# EAGLE design TRV_control_node (EAGLE 9.1.1)
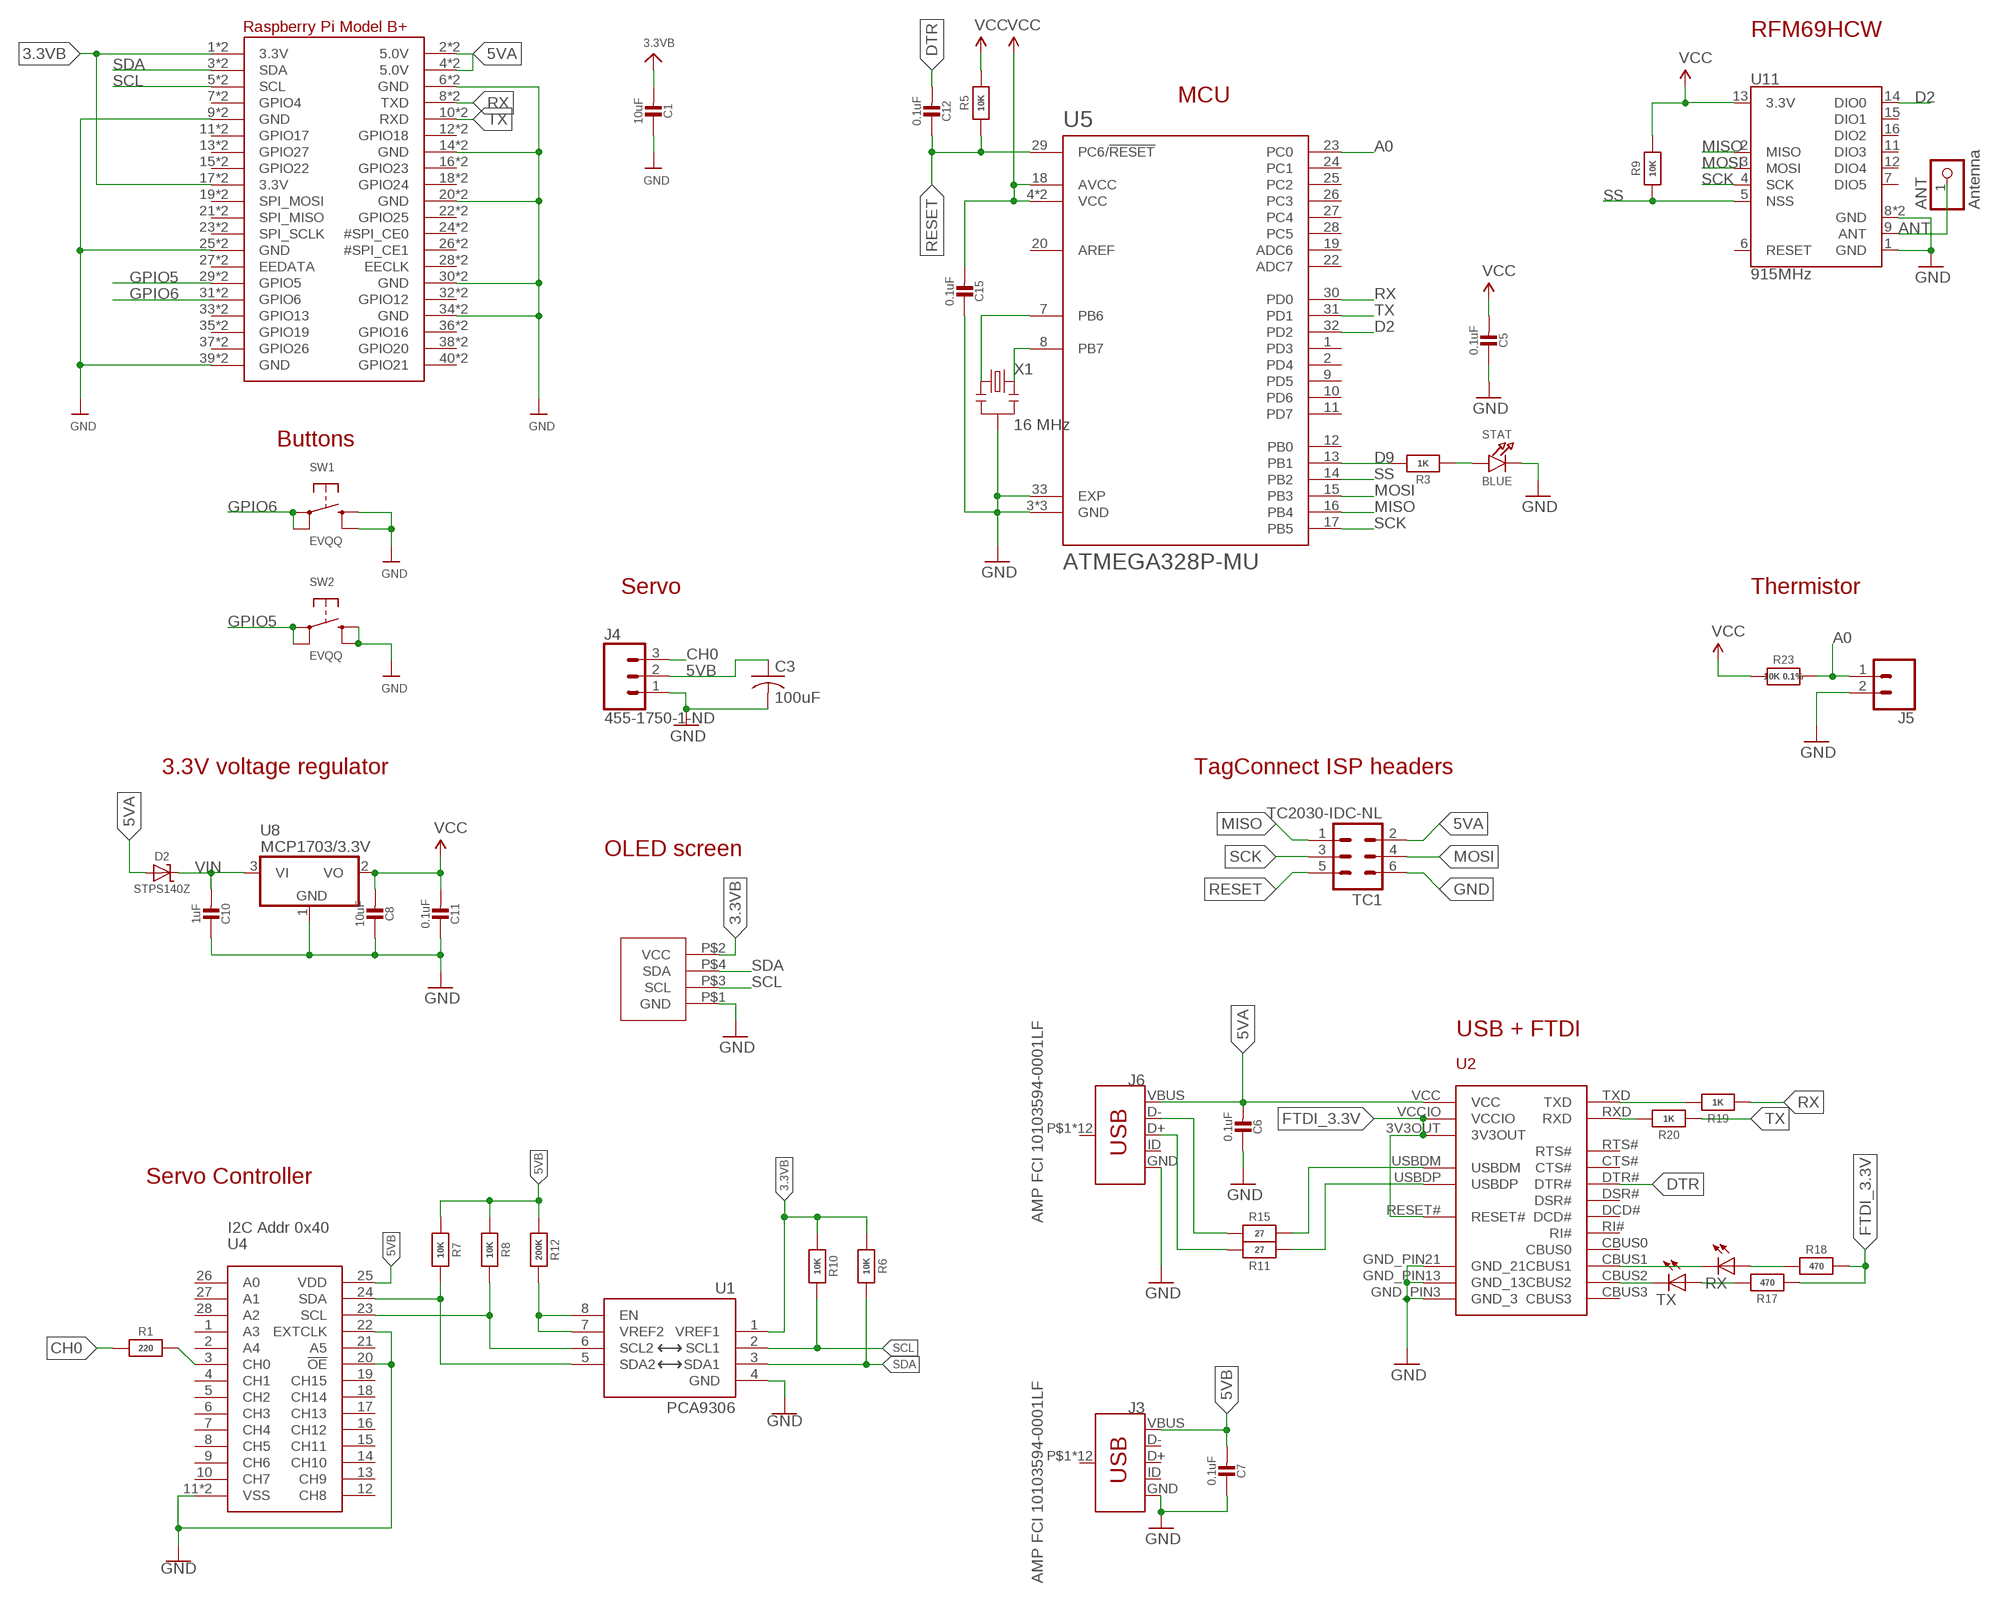
[diagram p0: schematic, sheet 1]

## Parts
ANT  Antenna  PINHD-1X1CB  [1X01-CLEANBIG]
C1  10uF  MICROBUILDER_CAP_CERAMIC_0402MP  [MICROBUILDER__0402MP]
C3  100uF  C-USC1210  [C1210]
C5  0.1uF  MICROBUILDER_CAP_CERAMIC_0402MP  [MICROBUILDER__0402MP]
C6  0.1uF  MICROBUILDER_CAP_CERAMIC_0402MP  [MICROBUILDER__0402MP]
C7  0.1uF  MICROBUILDER_CAP_CERAMIC_0402MP  [MICROBUILDER__0402MP]
C8  10uF  MICROBUILDER_CAP_CERAMIC_0402MP  [MICROBUILDER__0402MP]
C10  1uF  MICROBUILDER_CAP_CERAMIC_0402MP  [MICROBUILDER__0402MP]
C11  0.1uF  MICROBUILDER_CAP_CERAMIC_0402MP  [MICROBUILDER__0402MP]
C12  0.1uF  MICROBUILDER_CAP_CERAMIC_0402MP  [MICROBUILDER__0402MP]
C15  0.1uF  MICROBUILDER_CAP_CERAMIC_0402MP  [MICROBUILDER__0402MP]
D2  STPS140Z  MICROBUILDER_DIODE-SCHOTTKYSOD-123  [MICROBUILDER_SOD-123]
J3  AMP FCI 10103594-0001LF  USB_MICRO-B_HALF_PTH  [USB-MICROB-PTH]
J4  455-1750-1-ND  CONN_03  [1X03]
J5  CONN_02  [1X02]
J6  AMP FCI 10103594-0001LF  USB_MICRO-B_HALF_PTH  [USB-MICROB-PTH]
R1  220  MICROBUILDER_RESISTOR_0402MP  [MICROBUILDER__0402MP]
R3  1K  MICROBUILDER_RESISTOR_0402MP  [MICROBUILDER__0402MP]
R5  10K  MICROBUILDER_RESISTOR_0402MP  [MICROBUILDER__0402MP]
R6  10K  MICROBUILDER_RESISTOR_0402MP  [MICROBUILDER__0402MP]
R7  10K  MICROBUILDER_RESISTOR_0402MP  [MICROBUILDER__0402MP]
R8  10K  MICROBUILDER_RESISTOR_0402MP  [MICROBUILDER__0402MP]
R9  10K  MICROBUILDER_RESISTOR_0402MP  [MICROBUILDER__0402MP]
R10  10K  MICROBUILDER_RESISTOR_0402MP  [MICROBUILDER__0402MP]
R11  27  MICROBUILDER_RESISTOR_0402MP  [MICROBUILDER__0402MP]
R12  200K  MICROBUILDER_RESISTOR_0402MP  [MICROBUILDER__0402MP]
R15  27  MICROBUILDER_RESISTOR_0402MP  [MICROBUILDER__0402MP]
R17  470  MICROBUILDER_RESISTOR_0402MP  [MICROBUILDER__0402MP]
R18  470  MICROBUILDER_RESISTOR_0402MP  [MICROBUILDER__0402MP]
R19  1K  MICROBUILDER_RESISTOR_0402MP  [MICROBUILDER__0402MP]
R20  1K  MICROBUILDER_RESISTOR_0402MP  [MICROBUILDER__0402MP]
R23  10K 0.1%  MICROBUILDER_RESISTOR_0402MP  [MICROBUILDER__0402MP]
RPI1  RASPBERRYPI_BPLUS_BONNET_THMSMT  [PI_BONNET_THMSMT]
RX  LEDCHIPLED_0805  [CHIPLED_0805]
STAT  BLUE  LED0805_NOOUTLINE  [CHIPLED_0805_NOOUTLINE]
SW1  EVQQ  SWITCH_TACT_SMT_EVQQ2_SMALL  [EVQ-Q2_SMALLER]
SW2  EVQQ  SWITCH_TACT_SMT_EVQQ2_SMALL  [EVQ-Q2_SMALLER]
TC1  TC2030-IDC-NL  [TC2030-IDC-NL]
TX  LEDCHIPLED_0805  [CHIPLED_0805]
U1  PCA9306  [PSOP-8]
U2  FT231XQ-R  [FTDI_FT231XQ-R_PACKAGE]
U4  PCA9685HVQFN28  [HVQFN28_SOT788-1]
U5  ATMEGA328P-MU  [QFN50P500X500X100-33N]
U8  MCP1703/3.3V  MCP1703CB  [SOT23]
U11  915MHz  RFM69HCW-915  [RFM69HCW-XXXS2]
U$1  OLED_091_SSD1306  [OLED_128X32_0.91]
X1  16 MHz  RESONATORSMD  [RESONATOR-SMD]

## Nets
3.3VB: C1.2 R6.1 R10.1 RPI1.1(3.3V) RPI1.17(3.3V) RPI1.S1(3.3V) RPI1.S17(3.3V) U1.1(VREF1) U$1.P$2(VCC)
5VA: C6.2 D2.A J6.VBUS RPI1.2(5.0V) RPI1.4(5.0V) RPI1.S2(5.0V) RPI1.S4(5.0V) TC1.2 U2.VCC
5VB: C3.1 C7.2 J3.VBUS J4.2 R7.1 R8.1 R12.1 U4.25(VDD)
A0: J5.1 R23.2 U5.23(PC0)
ANT: ANT.1 U11.9(ANT)
CH0: J4.3 R1.1
D2: U5.32(PD2) U11.14(DIO0)
D9: R3.2 U5.13(PB1)
DTR: C12.2 U2.DTR#
FTDI_3.3V: R17.1 R18.2 U2.3V3OUT U2.RESET# U2.VCCIO
GND: C1.1 C3.2 C5.1 C6.1 C7.1 C8.1 C10.1 C11.1 C15.1 J3.GND J4.1 J5.2 J6.GND RPI1.6(GND) RPI1.9(GND) RPI1.14(GND) RPI1.20(GND) RPI1.25(GND) RPI1.30(GND) RPI1.34(GND) RPI1.39(GND) RPI1.S6(GND) RPI1.S9(GND) RPI1.S14(GND) RPI1.S20(GND) RPI1.S25(GND) RPI1.S30(GND) RPI1.S34(GND) RPI1.S39(GND) STAT.C SW1.B'(S1) SW1.B(S) SW2.B'(S1) SW2.B(S) TC1.6 U1.4(GND) U2.GND_PIN3(GND_3) U2.GND_PIN13(GND_13) U2.GND_PIN21(GND_21) U4.11(VSS) U4.20(!OE) U4.22(EXTCLK) U4.TH(VSS) U5.3(GND) U5.5(GND) U5.21(GND) U5.33(EXP) U8.1(GND) U11.1(GND) U11.8(GND) U11.10(GND) U$1.P$1(GND) X1.2
GPIO5: RPI1.29(GPIO5) RPI1.S29(GPIO5) SW2.A'(P1) SW2.A(P)
GPIO6: RPI1.31(GPIO6) RPI1.S31(GPIO6) SW1.A'(P1) SW1.A(P)
MISO: TC1.1 U5.16(PB4) U11.2(MISO)
MOSI: TC1.4 U5.15(PB3) U11.3(MOSI)
N$1: R12.2 U1.7(VREF2) U1.8(EN)
N$2: R20.2 U2.RXD
N$3: R19.2 U2.TXD
N$4: U5.8(PB7) X1.3
N$5: U5.7(PB6) X1.1
N$6: R8.2 U1.6(SCL2) U4.23(SCL)
N$7: R7.2 U1.5(SDA2) U4.24(SDA)
N$8: R3.1 STAT.A
N$9: R1.2 U4.3(CH0)
N$17: RX.C U2.CBUS1
N$18: TX.C U2.CBUS2
N$25: R15.2 U2.USBDM
N$26: R11.1 U2.USBDP
N$27: R18.1 RX.A
N$29: R17.2 TX.A
N$32: J6.D- R15.1
N$33: J6.D+ R11.2
RESET: C12.1 R5.1 TC1.5 U5.29(PC6/!RESET)
RX: R19.1 RPI1.8(TXD) RPI1.S8(TXD) U5.30(PD0)
SCK: TC1.3 U5.17(PB5) U11.4(SCK)
SCL: R10.2 RPI1.5(SCL) RPI1.S5(SCL) U1.2(SCL1) U$1.P$3(SCL)
SDA: R6.2 RPI1.3(SDA) RPI1.S3(SDA) U1.3(SDA1) U$1.P$4(SDA)
SS: R9.1 U5.14(PB2) U11.5(NSS)
TX: R20.1 RPI1.10(RXD) RPI1.S10(RXD) U5.31(PD1)
VCC: C5.2 C8.2 C11.2 C15.2 R5.2 R9.2 R23.1 U5.4(VCC) U5.6(VCC) U5.18(AVCC) U8.2(VO) U11.13(3.3V)
VIN: C10.2 D2.C U8.3(VI)
Unconnected: J3.D+ J3.D- J3.ID J3.P$1(SHIELD) J3.P$2(SHIELD) J3.P$3(SHIELD) J3.P$4(SHIELD) J3.P$6(SHIELD) J3.P$8(SHIELD) J3.P$10(SHIELD) J3.P$12(SHIELD) J3.SHEILD2(SHIELD) J3.SHIELD J3.SHIELD3(SHIELD) J3.SHIELD4(SHIELD) J6.ID J6.P$1(SHIELD) J6.P$2(SHIELD) J6.P$3(SHIELD) J6.P$4(SHIELD) J6.P$6(SHIELD) J6.P$8(SHIELD) J6.P$10(SHIELD) J6.P$12(SHIELD) J6.SHEILD2(SHIELD) J6.SHIELD J6.SHIELD3(SHIELD) J6.SHIELD4(SHIELD) RPI1.7(GPIO4) RPI1.11(GPIO17) RPI1.12(GPIO18) RPI1.13(GPIO27) RPI1.15(GPIO22) RPI1.16(GPIO23) RPI1.18(GPIO24) RPI1.19(SPI_MOSI) RPI1.21(SPI_MISO) RPI1.22(GPIO25) RPI1.23(SPI_SCLK) RPI1.24(#SPI_CE0) RPI1.26(#SPI_CE1) RPI1.27(EEDATA) RPI1.28(EECLK) RPI1.32(GPIO12) RPI1.33(GPIO13) RPI1.35(GPIO19) RPI1.36(GPIO16) RPI1.37(GPIO26) RPI1.38(GPIO20) RPI1.40(GPIO21) RPI1.S7(GPIO4) RPI1.S11(GPIO17) RPI1.S12(GPIO18) RPI1.S13(GPIO27) RPI1.S15(GPIO22) RPI1.S16(GPIO23) RPI1.S18(GPIO24) RPI1.S19(SPI_MOSI) RPI1.S21(SPI_MISO) RPI1.S22(GPIO25) RPI1.S23(SPI_SCLK) RPI1.S24(#SPI_CE0) RPI1.S26(#SPI_CE1) RPI1.S27(EEDATA) RPI1.S28(EECLK) RPI1.S32(GPIO12) RPI1.S33(GPIO13) RPI1.S35(GPIO19) RPI1.S36(GPIO16) RPI1.S37(GPIO26) RPI1.S38(GPIO20) RPI1.S40(GPIO21) U2.CBUS0 U2.CBUS3 U2.CTS# U2.DCD# U2.DSR# U2.RI# U2.RTS# U4.1(A3) U4.2(A4) U4.4(CH1) U4.5(CH2) U4.6(CH3) U4.7(CH4) U4.8(CH5) U4.9(CH6) U4.10(CH7) U4.12(CH8) U4.13(CH9) U4.14(CH10) U4.15(CH11) U4.16(CH12) U4.17(CH13) U4.18(CH14) U4.19(CH15) U4.21(A5) U4.26(A0) U4.27(A1) U4.28(A2) U5.1(PD3) U5.2(PD4) U5.9(PD5) U5.10(PD6) U5.11(PD7) U5.12(PB0) U5.19(ADC6) U5.20(AREF) U5.22(ADC7) U5.24(PC1) U5.25(PC2) U5.26(PC3) U5.27(PC4) U5.28(PC5) U11.6(RESET) U11.7(DIO5) U11.11(DIO3) U11.12(DIO4) U11.15(DIO1) U11.16(DIO2)

## Notes on the sheet
- RFM69HCW
- MCU
- Buttons
- Servo | Thermistor
- 3.3V voltage regulator | TagConnect ISP headers
- OLED screen
- USB + FTDI
- Servo Controller
- I2C Addr 0x40

## Library data of the parts
ANT = adafruit@1:PINHD-1X1: Pin header 1x1 for 0.1" spacing With round pins; MPN: Helical antenna
C1 C5-C8 C10-C12 C15 = Adafruit Feather 32u4 Bluefruit LE:MICROBUILDER_CAP_CERAMIC: Ceramic Capacitors For new designs, use the packages preceded by an '_' character since they are more reliable: The following footprints should be used on most boards: _0402 - Standard footprint for regular board layouts _0603 - Standard footprint for regular board layouts _0805 - Standard footprint for regular board layouts _1206 - Standard footprint for regular board layouts For extremely tight-pitch boards where space is at a premium, the following 'micro-pitch' footprints can be used (smaller pads, no silkscreen outline, etc.): _0402MP - Micro-pitch footprint for very dense/compact boards _0603MP - Micro-pitch footprint for very dense/compact boards _0805MP - Micro-pitch footprint for very dense/compact boards _1206MP - Micro-pitch footprint for very dense/compact boards; MPN: GRM155R71C104KA88J
C3 = adafruit:C-US: CAPACITOR, American symbol
D2 = Adafruit Feather 32u4 Bluefruit LE:MICROBUILDER_DIODE-SCHOTTKY; MPN: SD103AW-13-F
J3 J6 = SparkFun-Connectors:USB_MICRO-B: USB Type Micro-B Connector Male/female and PTH/SMT variants SparkFun Products: SparkFun microB USB Breakout <https://www.sparkfun.com/products/12035> SparkFun USB microB Plug Breakout <https://www.sparkfun.com/products/10031> SparkFun ESP8266 Thing <https://www.sparkfun.com/products/13231>; PROD_ID: CONN-13711
J4 = SparkFun-Connectors:CONN_03: Multi connection point. Often used as Generic Header-pin footprint for 0.1 inch spaced/style header connections On any of the 0.1 inch spaced packages, you can populate with these: Break Away Headers - Straight <https://www.sparkfun.com/products/116> (PRT-00116) Break Away Male Headers - Right Angle <https://www.sparkfun.com/products/553> (PRT-00553) Female Headers <https://www.sparkfun.com/products/115> (PRT-00115) Break Away Headers - Machine Pin <https://www.sparkfun.com/products/117> (PRT-00117) Break Away Female Headers - Swiss Machine Pin <https://www.sparkfun.com/products/743> (PRT-00743) Stackable Header - 3 Pin (Female, 0.1") <https://www.sparkfun.com/products/13875> (PRT-13875) For SCREWTERMINALS and SPRING TERMINALS visit here: Screw Terimnals on SparkFun.com <https://www.sparkfun.com/search/results?term=Screw+Terminals> (5mm/3.5mm/2.54mm spacing) This device is also useful as a general connection point to wire up your design to another part of your project. Our various solder wires solder well into these plated through hole pads. Hook-Up Wire - Assortment (Stranded, 22 AWG) <https://www.sparkfun.com/products/11375> (PRT-11375) Hook-Up Wire - Assortment (Solid Core, 22 AWG) <https://www.sparkfun.com/products/11367> (PRT-11367) View the entire wire category on our website here <https://www.sparkfun.com/categories/141> Special notes: Molex polarized connector foot print use with SKU : PRT-08232 with associated crimp pins and housings.; PROD_ID: XXX-00000
J5 = SparkFun-Connectors:CONN_02: Multi connection point. Often used as Generic Header-pin footprint for 0.1 inch spaced/style header connections On any of the 0.1 inch spaced packages, you can populate with these: Break Away Headers - Straight <https://www.sparkfun.com/products/116> (PRT-00116) Break Away Male Headers - Right Angle <https://www.sparkfun.com/products/553> (PRT-00553) Female Headers <https://www.sparkfun.com/products/115> (PRT-00115) Break Away Headers - Machine Pin <https://www.sparkfun.com/products/117> (PRT-00117) Break Away Female Headers - Swiss Machine Pin <https://www.sparkfun.com/products/743> (PRT-00743) For SCREWTERMINALS and SPRING TERMINALS visit here: Screw Terimnals on SparkFun.com <https://www.sparkfun.com/search/results?term=Screw+Terminals> (5mm/3.5mm/2.54mm spacing) This device is also useful as a general connection point to wire up your design to another part of your project. Our various solder wires solder well into these plated through hole pads. Hook-Up Wire - Assortment (Stranded, 22 AWG) <https://www.sparkfun.com/products/11375> (PRT-11375) Hook-Up Wire - Assortment (Solid Core, 22 AWG) <https://www.sparkfun.com/products/11367> (PRT-11367) View the entire wire category on our website here <https://www.sparkfun.com/categories/141> Special notes: Molex polarized connector foot print use with: PRT-08233 with associated crimp pins and housings. 2.54_SCREWTERM for use with PRT-10571. 3.5mm Screw Terminal footprints for PRT-08084 5mm Screw Terminal footprints for use with PRT-08432
R1 R6-R8 R10 R12 R19 R20 = Adafruit Feather 32u4 Bluefruit LE:MICROBUILDER_RESISTOR: Resistors For new designs, use the packages preceded by an '_' character since they are more reliable: The following footprints should be used on most boards: _0402 - Standard footprint for regular board layouts _0603 - Standard footprint for regular board layouts _0805 - Standard footprint for regular board layouts _1206 - Standard footprint for regular board layouts For extremely tight-pitch boards where space is at a premium, the following 'micro-pitch' footprints can be used (smaller pads, no silkscreen outline, etc.): _0402MP - Micro-pitch footprint for very dense/compact boards _0603MP - Micro-pitch footprint for very dense/compact boards _0805MP - Micro-pitch footprint for very dense/compact boards _1206MP - Micro-pitch footprint for very dense/compact boards; MPN: RC0402JR-071KL
R3 R5 R9 = Adafruit Feather 32u4 Bluefruit LE:MICROBUILDER_RESISTOR: Resistors For new designs, use the packages preceded by an '_' character since they are more reliable: The following footprints should be used on most boards: _0402 - Standard footprint for regular board layouts _0603 - Standard footprint for regular board layouts _0805 - Standard footprint for regular board layouts _1206 - Standard footprint for regular board layouts For extremely tight-pitch boards where space is at a premium, the following 'micro-pitch' footprints can be used (smaller pads, no silkscreen outline, etc.): _0402MP - Micro-pitch footprint for very dense/compact boards _0603MP - Micro-pitch footprint for very dense/compact boards _0805MP - Micro-pitch footprint for very dense/compact boards _1206MP - Micro-pitch footprint for very dense/compact boards; MPN: RC0402JR-0710KL
R11 R15 R23 = Adafruit Feather 32u4 Bluefruit LE:MICROBUILDER_RESISTOR: Resistors For new designs, use the packages preceded by an '_' character since they are more reliable: The following footprints should be used on most boards: _0402 - Standard footprint for regular board layouts _0603 - Standard footprint for regular board layouts _0805 - Standard footprint for regular board layouts _1206 - Standard footprint for regular board layouts For extremely tight-pitch boards where space is at a premium, the following 'micro-pitch' footprints can be used (smaller pads, no silkscreen outline, etc.): _0402MP - Micro-pitch footprint for very dense/compact boards _0603MP - Micro-pitch footprint for very dense/compact boards _0805MP - Micro-pitch footprint for very dense/compact boards _1206MP - Micro-pitch footprint for very dense/compact boards; MPN: RC0402JR-0727RL
R17 R18 = Adafruit Feather 32u4 Bluefruit LE:MICROBUILDER_RESISTOR: Resistors For new designs, use the packages preceded by an '_' character since they are more reliable: The following footprints should be used on most boards: _0402 - Standard footprint for regular board layouts _0603 - Standard footprint for regular board layouts _0805 - Standard footprint for regular board layouts _1206 - Standard footprint for regular board layouts For extremely tight-pitch boards where space is at a premium, the following 'micro-pitch' footprints can be used (smaller pads, no silkscreen outline, etc.): _0402MP - Micro-pitch footprint for very dense/compact boards _0603MP - Micro-pitch footprint for very dense/compact boards _0805MP - Micro-pitch footprint for very dense/compact boards _1206MP - Micro-pitch footprint for very dense/compact boards; MPN: RC0402JR-07470RL
RPI1 = microbuilder:RASPBERRYPI_BPLUS
RX TX = adafruit:LED: LED; MPN: LG R971-KN-1; OC_NEWARK: unknown
STAT = microbuilder:LED: LED
SW1 SW2 = microbuilder:SWITCH_TACT_SMT: SMT Tact Switches 6x6mm - Digikey: P12940SCT-ND KMR2 (4.6x2.8mm) - Digikey: 401-1426-1-ND EVQ-PQHB55 - Light Touch, 160GF (4.5x4.5mm) - Digikey: P8090SCT-ND KMT0 - KMT021 NGJ LHS (etc.) IP68/Waterproof - Digikey: CKN10289CT-ND
TC1 = TagConnect:TC2030-IDC: Tag-Connect In Circuit Programming & Debug Cable 6 Pin http://www.tag-connect.com
U1 = SparkFun-IC-Comms:PCA9306: Bidirectional I2C level shifter Not compatible with all available part number pinout schemes- DOUBLE CHECK!!! Datasheet <https://cdn.sparkfun.com/datasheets/BreakoutBoards/PCA9306DC.pdf> SparkFun Products SparkFun Inventor's Kit for RedBot <https://www.sparkfun.com/products/12649> (ROB-12649) SparkFun RedBot Basic Kit <https://www.sparkfun.com/products/13166> (ROB-13166) SparkFun Level Translator Breakout - PCA9306 <https://www.sparkfun.com/products/11955> (BOB-11955) SparkFun Block for Intel Edison - ADC <https://www.sparkfun.com/products/13770> (DEV-13770) SparkFun Block for Intel® Edison - Raspberry Pi B <https://www.sparkfun.com/products/13044> (DEV-13044) SparkFun RedBot Sensor - Accelerometer <https://www.sparkfun.com/products/12589> (SEN-12589); PROD_ID: IC-10023
U2 = ftdi_ft231xq-r:FT231XQ-R: This is the 20-LD QFN package of the FTDI FT231XQ-R chip.; MPN: FT231XQ-R
U4 = PCA9685:PCA9685: 16-channel 12-bit PWM I2C interface Internal Oscillator 40Hz to 1kHz Can be totem pole or open collector 2.3V to 5.5V SparkFun Products SparkFun Block for Intel® Edison - PWM <https://www.sparkfun.com/products/13042> (DEV-13042) PROTO: IC-12240 PROD_ID: IC-12271
U5 = ATMEGA328P-MU:ATMEGA328P-MU: ATmega Series 20 MHz 32 KB Flash 2 KB SRAM 8-Bit Microcontroller - QFN-32; AVAILABILITY: Good; DESCRIPTION: ATmega Series 20 MHz 32 KB Flash 2 KB SRAM 8-Bit Microcontroller - QFN-32; MF: Atmel; MP: ATMEGA328P-MU; MPN: ATMEGA328P-MU; PACKAGE: QFN-32 Atmel; PRICE: 2.55 USD
U8 = linear:MCP1703: 250 mA, 16V, Low Quiescent Current LDO Regulator Source: http://ww1.microchip.com/downloads/en/DeviceDoc/22049b.pdf; MPN: MCP1703T-3302E/CB; OC_NEWARK: 18T9177
U11 = SparkFun-RF:RFM69H: Hope RF RFM69H ISM Transceiver Module The RFM69H is a transceiver module capable of operation over a wide frequency range, including the 315,433,868 and 915MHz license-free ISM (Industry Scientific and Medical) frequency bands. All major RF communication parameters are programmable and most of them can be dynamically set. The RFM69H offers the unique advantage of programmable narrow-band and wide- band communication modes. The RFM69H is optimized for low power consumption while offering high RF output power and channelized operation.Compliance ETSI and FCC regulations. Datasheet <http://www.hoperf.cn/upload/docs/RF/SX/RFM69H_DataSheet_v1.3.pdf> SparkFun Products RFM69HCW Wireless Transceiver - 915MHz <https://www.sparkfun.com/products/13909> (COM-13909) RFM69HCW Wireless Transceiver - 434MHz <https://www.sparkfun.com/products/13910> (COM-13910) SparkFun RFM69 Breakout (915MHz) <https://www.sparkfun.com/products/12775> (WRL-12775) SparkFun RFM69 Breakout (434MHz) <https://www.sparkfun.com/products/12823> (WRL-12823); MPN: RFM69HCW; PROD_ID: IC-11997
U$1 = oled_096_SSD1306:OLED_091_SSD1306
X1 = SparkFun:RESONATOR: Resonator Small SMD resonator. This is the itty bitty 10/20MHz resonators with built in caps. CSTCE10M0G55 and CSTCE20M0V53. Footprint has been reviewed closely but hasn't been tested yet.; MPN: CSTCE16M0V53-R0

## Net classes
1 power: width 0.381 mm, clearance 0.254 mm

## Board
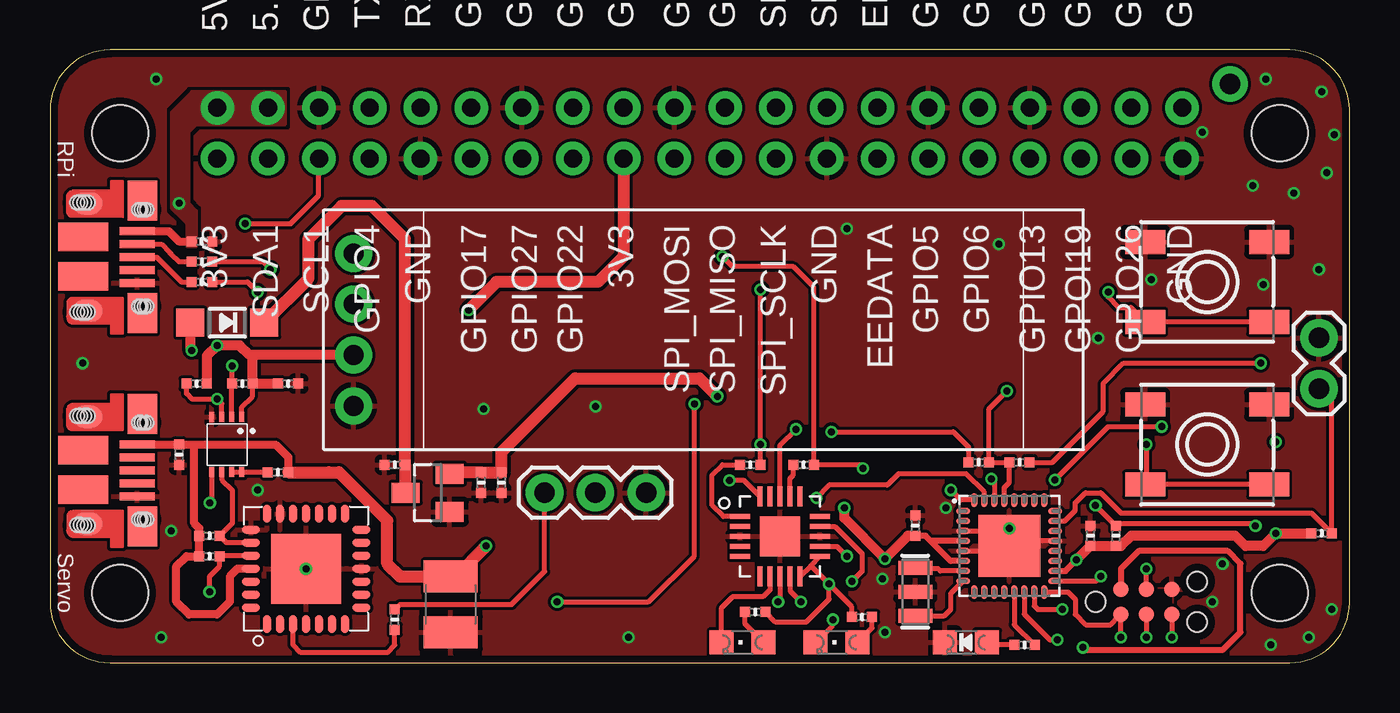
[diagram p1: board, top side]
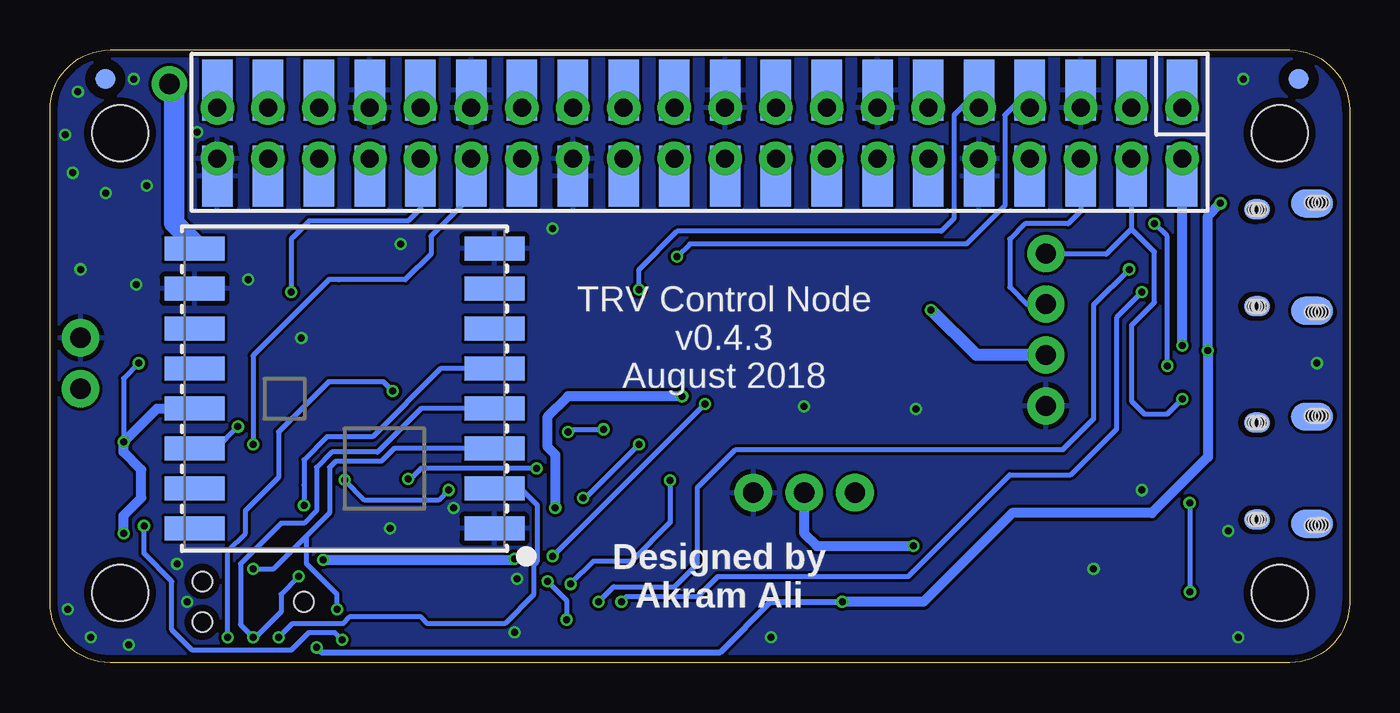
[diagram p2: board, bottom side, seen from below]

Size 65 x 30.66 mm. Coordinates in mm from the lower left corner, seen from the top.
Copper layers (1*16): Top 0.035559375mm / dielectric 1.6mm / Bottom 0.035559375mm
Design rules "oshpark-2layer": minimum track width 6mil, minimum drill 10mil, track to track 6mil, track to pad 6mil, pad to pad 6mil, via to via 6mil, smd to smd 6mil, copper to edge 15mil, drill to drill 6mil, minimum pad ring 5mil, minimum via ring 5mil, stop-mask expansion 2.5mil, vias tented up to drill 0mil, thermal gap 10mil

### Footprints (pad centres in the part's own frame; a part is rotated, then mirrored left to right if it is on the bottom)
1X01-CLEANBIG = drill 1.016 pad 1.778: 1 0,0
MICROBUILDER__0402MP = smd 0.5 x 0.5: 1 -0.508,0; 2 0.508,0
C1210 = smd 1.6 x 2.7: 1 -1.4,0; 2 1.4,0
MICROBUILDER_SOD-123 = smd 1.4 x 1.4: A 1.85,0; C -1.85,0
USB-MICROB-PTH = smd 0.4 x 1.75: D+ 0.031,1.331; D- -0.619,1.331; GND 1.331,1.331; ID 0.681,1.331; VBUS -1.269,1.331 | smd 1.4 x 2.1 bottom: P$1 2.701,-1.142; P$3 -2.659,-1.144 | smd 1 x 1.3: P$2 2.487,1.594; P$6 -2.368,1.604 | smd 1 x 1.3 bottom: P$4 -2.368,1.604; P$10 2.481,1.598 | smd 1.1 x 1.5: P$8 2.701,-1.142; P$12 -2.659,-1.144 | smd 2 x 1.46: SHEILD2 2.831,1.606; SHIELD -2.794,1.606 | smd 1.425 x 2.5: SHIELD3 -0.979,-1.349; SHIELD4 0.996,-1.352 | hole 0.7: -2.693,-1.134; -2.693,-1.3; -2.694,-1.499; -2.694,-1.664; 2.768,-1.134; 2.767,-1.303; 2.766,-1.496; 2.766,-1.664 | hole 0.66: -2.359,1.821; -2.349,1.691; -2.359,1.541; -2.354,1.432; 2.481,1.821; 2.491,1.691; 2.481,1.541; 2.486,1.432
1X03 = drill 1.016 pad 1.88: 1 0,0; 2 2.54,0; 3 5.08,0
1X02 = drill 1.016 pad 1.88: 1 0,0; 2 2.54,0
PI_BONNET_THMSMT = drill 0.9 pad 1.676: 1 8.37,25.23; 2 8.37,27.77; 3 10.91,25.23; 4 10.91,27.77; 5 13.45,25.23; 6 13.45,27.77; 7 15.99,25.23; 8 15.99,27.77; 9 18.53,25.23; 10 18.53,27.77; 11 21.07,25.23; 12 21.07,27.77; 13 23.61,25.23; 14 23.61,27.77; 15 26.15,25.23; 16 26.15,27.77; 17 28.69,25.23; 18 28.69,27.77; 19 31.23,25.23; 20 31.23,27.77; 21 33.77,25.23; 22 33.77,27.77; 23 36.31,25.23; 24 36.31,27.77; 25 38.85,25.23; 26 38.85,27.77; 27 41.39,25.23; 28 41.39,27.77; 29 43.93,25.23; 30 43.93,27.77; 31 46.47,25.23; 32 46.47,27.77; 33 49.01,25.23; 34 49.01,27.77; 35 51.55,25.23; 36 51.55,27.77; 37 54.09,25.23; 38 54.09,27.77; 39 56.63,25.23; 40 56.63,27.77 | smd 1 x 1 bottom: 41 2.54,29.21; 42 62.23,29.21 | smd 1.524 x 3.048 bottom: S1 8.37,24.339; S2 8.37,28.657; S3 10.91,24.339; S4 10.91,28.657; S5 13.45,24.339; S6 13.45,28.657; S7 15.99,24.339; S8 15.99,28.657; S9 18.53,24.339; S10 18.53,28.657; S11 21.07,24.339; S12 21.07,28.657; S13 23.61,24.339; S14 23.61,28.657; S15 26.15,24.339; S16 26.15,28.657; S17 28.69,24.339; S18 28.69,28.657; S19 31.23,24.339; S20 31.23,28.657; S21 33.77,24.339; S22 33.77,28.657; S23 36.31,24.339; S24 36.31,28.657; S25 38.85,24.339; S26 38.85,28.657; S27 41.39,24.339; S28 41.39,28.657; S29 43.93,24.339; S30 43.93,28.657; S31 46.47,24.339; S32 46.47,28.657; S33 49.01,24.339; S34 49.01,28.657; S35 51.55,24.339; S36 51.55,28.657; S37 54.09,24.339; S38 54.09,28.657; S39 56.63,24.339; S40 56.63,28.657 | hole 2.8: 3.5,26.5; 61.5,26.5; 61.5,3.5; 3.5,3.5
CHIPLED_0805 = smd 1.2 x 1.2: A 0,-1.05; C 0,1.05
CHIPLED_0805_NOOUTLINE = smd 1.2 x 1.2: A 0,-1.05; C 0,1.05
EVQ-Q2_SMALLER = smd 2 x 1.2: A -3.1,-2; A' 3.1,-2; B -3.1,2; B' 3.1,2
TC2030-IDC-NL = smd 0.787 x 0.787: 1 -1.27,-0.635; 2 -1.27,0.635; 3 0,-0.635; 4 0,0.635; 5 1.27,-0.635; 6 1.27,0.635 | hole 0.991: -2.54,0; 2.54,1.016; 2.54,-1.016
PSOP-8 = smd 0.25 x 0.5: 1 -0.73,-1.37; 2 -0.23,-1.37; 3 0.27,-1.37; 4 0.77,-1.37; 5 0.77,1.38; 6 0.27,1.38; 7 -0.23,1.38; 8 -0.73,1.38
FTDI_FT231XQ-R_PACKAGE = smd 0.25 x 1: 3V3OUT 0.968,-2.032; CBUS2 -0.532,-2.032; CBUS3 0.968,1.968; CTS# -1.032,-2.032; DTR# -0.032,1.968; RTS# -0.532,1.968; TXD 0.468,1.968; USBDM 0.468,-2.032; USBDP -0.032,-2.032; VCCIO -1.032,1.968 | smd 1 x 0.25: CBUS0 1.968,0.968; CBUS1 1.968,0.468; DCD# -2.032,-1.032; DSR# -2.032,-0.532; GND_PIN3 -2.032,-0.032; GND_PIN13 1.968,-0.032; RESET# 1.968,-1.032; RI# -2.032,0.468; RXD -2.032,0.968; VCC 1.968,-0.532 | smd 2 x 2: GND_PIN21 -0.032,-0.032
HVQFN28_SOT788-1 = smd 0.9 x 0.4: 1 1.035,5.76; 2 1.035,5.11; 3 1.035,4.46; 4 1.035,3.81; 5 1.035,3.16; 6 1.035,2.51; 7 1.035,1.86; 15 6.56,1.86; 16 6.56,2.51; 17 6.56,3.16; 18 6.56,3.81; 19 6.56,4.46; 20 6.56,5.11; 21 6.56,5.76 | smd 0.4 x 0.9: 8 1.86,1.035; 9 2.51,1.035; 10 3.16,1.035; 11 3.81,1.035; 12 4.46,1.035; 13 5.11,1.035; 14 5.76,1.035; 22 5.76,6.56; 23 5.11,6.56; 24 4.46,6.56; 25 3.81,6.56; 26 3.16,6.56; 27 2.51,6.56; 28 1.86,6.56 | smd 3.5 x 3.5: TH 3.81,3.81
QFN50P500X500X100-33N = smd 0.7 x 0.3: 1 -2.3,1.75; 2 -2.3,1.25; 3 -2.3,0.75; 4 -2.3,0.25; 5 -2.3,-0.25; 6 -2.3,-0.75; 7 -2.3,-1.25; 8 -2.3,-1.75; 17 2.3,-1.75; 18 2.3,-1.25; 19 2.3,-0.75; 20 2.3,-0.25; 21 2.3,0.25; 22 2.3,0.75; 23 2.3,1.25; 24 2.3,1.75 | smd 0.3 x 0.7: 9 -1.75,-2.3; 10 -1.25,-2.3; 11 -0.75,-2.3; 12 -0.25,-2.3; 13 0.25,-2.3; 14 0.75,-2.3; 15 1.25,-2.3; 16 1.75,-2.3; 25 1.75,2.3; 26 1.25,2.3; 27 0.75,2.3; 28 0.25,2.3; 29 -0.25,2.3; 30 -0.75,2.3; 31 -1.25,2.3; 32 -1.75,2.3 | smd 3.1 x 3.1: 33 0,0
SOT23 = smd 1 x 1.4: 1 -0.95,-1.1; 2 0.95,-1.1; 3 0,1.1
RFM69HCW-XXXS2 = smd 3 x 1.2: 1 -7.5,7; 2 -7.5,5; 3 -7.5,3; 4 -7.5,1; 5 -7.5,-1; 6 -7.5,-3; 7 -7.5,-5; 8 -7.5,-7; 9 7.5,-7; 10 7.5,-5; 11 7.5,-3; 12 7.5,-1; 13 7.5,1; 14 7.5,3; 15 7.5,5; 16 7.5,7
OLED_128X32_0.91 = drill 1 pad 1.85: P$1 1.5,2.19; P$2 1.5,4.73; P$3 1.5,7.27; P$4 1.5,9.81
RESONATOR-SMD = smd 0.7 x 1.7: 1 -1.2,0; 2 0,0; 3 1.2,0

### Placement (x,y rotation side)
ANT  59.03,28.96 0 top
C1  11.91,13.97 180 top
C3  20.04,2.92 270 top
C5  52.04,6.35 270 top
C6  7.59,21.08 180 top
C7  6.45,10.41 90 top
C8  21.56,9.02 90 top
C10  17.25,9.91 0 top
C11  22.58,9.02 90 top
C12  46.46,10.03 180 top
C15  43.28,6.86 270 top
D2  8.86,17.02 180 top
J3  3.02,9.65 270 top
J4  29.82,8.51 180 top
J5  63.47,13.72 90 top
J6  3.02,20.32 270 top
R1  17.25,2.16 270 top
R3  48.74,0.89 0 top
R5  48.49,10.03 0 top
R6  7.34,13.97 180 top
R7  7.98,5.33 0 top
R8  7.98,6.35 0 top
R9  53.31,6.35 270 top
R10  9.63,13.97 180 top
R11  7.59,19.05 180 top
R12  11.4,9.53 180 top
R15  7.59,20.07 0 top
R17  35.28,2.54 180 top
R18  40.61,2.29 180 top
R19  37.69,9.91 180 top
R20  35.03,9.91 180 top
R23  63.6,6.48 0 top
RPI1  0,0 0 top
RX  39.34,1.02 90 top
STAT  45.82,1.02 90 top
SW1  57.89,19.05 0 top
SW2  57.89,10.92 0 top
TC1  54.84,3.05 0 top
TX  34.65,1.02 90 top
U1  8.86,10.92 180 top
U2  36.55,6.35 0 top
U4  16.61,0.89 90 top
U5  47.98,5.84 0 top
U8  18.9,8.51 90 top
U11  50.27,13.72 180 bottom
U$1  13.69,10.67 0 top
X1  43.28,3.56 270 top

### Tracks (layer width: path | path; a pad name or v marks a point on that pad's centre or on a via)
3.3VB  (via drill 0.35)
  Top 0.254: U1.1 9.59,12.79 10.13,13.34 R10.1
  Top 0.508: C1.2 R10.1 10.13,15.24 9.98,15.4 | R6.1 7.85,15.37 v8.36,15.88 9.5,15.88 9.98,15.4 | U$1.P$2 9.98,15.4
  Top 0.61: RPI1.17 28.69,20.33 27.41,19.05 22.33,19.05 v20.93,17.65
  Bottom 0.254: RPI1.S17 RPI1.17 | RPI1.17 | RPI1.S1 RPI1.1 | RPI1.1
  Bottom 0.508: v8.36,15.88 8.36,25.22 RPI1.1
  Bottom 0.61: U$1.P$2 18.67,15.4 v20.93,17.65
5VA  (via drill 0.35)
  Top 0.254: U2.VCC 39.37,5.82 v39.85,5.33 | v25.37,3.05 29.95,3.05 32.23,5.33 v32.23,12.95
  Top 0.305: TC1.2 53.57,4.7 54.46,5.59 58.9,5.59 59.54,4.95 59.54,1.52 58.65,0.64 51.79,0.64 v51.66,0.76
  Top 0.406: J6.VBUS 5.94,21.59 6.45,21.08 C6.2
  Top 0.508: D2.A 7.01,15.69 v7.09,15.62
  Bottom 0.254: v39.85,5.33 v32.23,12.95 | RPI1.S2 RPI1.2 | RPI1.2 | RPI1.S4 RPI1.4 | RPI1.4
  Bottom 0.305: v51.66,0.76 51.43,0.53 31.47,0.53 28.96,3.05 v25.37,3.05
  Bottom 0.508: v6.45,22.99 7.09,22.35 v7.09,15.62 7.09,10.29 9.88,7.49 16.87,7.49 21.31,3.05 v25.37,3.05
  pour Top (no thermals): 7.34,20.83 7.34,22.61 6.96,22.99 6.96,26.54 7.34,26.92 11.79,26.92 11.79,28.57 7.09,28.57 6.07,27.56 6.07,22.73 6.58,22.23 6.83,21.97 6.83,21.21 6.83,20.83
5VB  (via drill 0.35)
  Top 0.406: 7.21,10.92 C7.2 J3.VBUS | 7.21,10.92 11.28,10.92 11.91,10.29 R12.1 | U4.25 9.37,4.7 8.99,4.32 8.99,3.05 8.36,2.41 6.96,2.41 6.32,3.05 6.32,4.83 6.83,5.33 R7.1 R8.1 7.47,6.73 7.21,6.99 7.21,10.92
  Top 0.61: R12.1 13.94,9.53 14.45,9.53 16.87,7.11 16.87,4.95 17.5,4.32 C3.1 20.3,4.32 v21.82,5.84
  Bottom 0.508: J4.2 27.28,6.48 26.64,5.84 v21.82,5.84
A0
  Top 0.254: U5.23 50.75,7.09 51.28,7.62 51.28,8 51.79,8.51 52.55,8.51 53.57,7.49 63.09,7.49 R23.2 64.11,13.08 J5.1
ANT
  Bottom 1.016: ANT.1 58.78,28.71 58.78,21.99 57.77,20.97 U11.9
CH0
  Top 0.254: J4.3 24.74,4.57 23.09,2.92 17.5,2.92 R1.1
D2  (via drill 0.35)
  Top 0.254: U5.32 45.55,8.14 v45.06,8.64 | v50.27,9.14 52.93,11.81 v55.6,11.81
  Bottom 0.254: v45.06,8.64 45.57,8.13 49.25,8.13 v50.27,9.14 | v55.6,11.81 56.74,10.67 57.72,10.67 U11.14
D9
  Top 0.254: R3.2 48.23,1.91 U5.13
DTR  (via drill 0.35)
  Top 0.254: U2.DTR# 36.52,10.89 v37.31,11.68 | v39.09,11.56 45.19,11.56 45.95,10.79 C12.2
  Bottom 0.254: v39.09,11.56 38.96,11.68 v37.31,11.68
FTDI_3.3V  (via drill 0.35)
  Top 0.254: U2.3V3OUT 38.05,4.85 | 38.05,4.85 U2.RESET# | v38.96,3.94 38.05,4.85 | U2.VCCIO 34.72,9.12 v33.98,9.12 | R18.2 40.11,2.79 v38.96,3.94 | v38.96,3.94 38.96,3.17 37.82,2.03 36.3,2.03 R17.1
  Bottom 0.254: v33.98,9.12 33.98,7.01 35.92,5.08 37.82,5.08 v38.96,3.94
GND  (via drill 0.35)
  Top 0.254: U5.5 47.73,5.59 U5.33 48.04,5.91 | U5.21 48.23,6.09 48.04,5.91 | U5.3 47.36,6.59 48.04,5.91
  other vias: 6.07,6.6 28.93,1.27 21.69,12.7 64.11,2.67 60.17,23.88 47.47,20.95 39.85,21.72 47.98,6.73 61.06,0.89 52.43,16.26 27.28,12.83 5.56,1.27 10.39,8.64 1.63,14.99 5.31,29.21 63.47,19.68 63.6,28.57 58.14,3.05 41.76,1.52 12.8,4.7 63.86,24.51 62.2,23.5 64.24,26.42 60.81,29.21 57.63,26.54 60.68,18.92 55.09,19.18 62.97,1.27 58.65,4.95 44.81,7.75 41.63,4.19
  pour Top (rank 6): -0.03,30.48 -0.03,0 65.25,0 65.25,30.48
  pour Bottom: -0.03,32.26 66.78,32.26 66.78,-2.03 -1.3,-2.03 -1.3,32.26
GPIO5  (via drill 0.35)
  Top 0.254: SW2.A' SW2.A 54.84,8.97 v54.84,10.92
  Bottom 0.254: v54.84,10.92 54.84,15.37 51.03,19.18 50.57,19.18 50.56,19.16 47.23,19.16 45.95,20.45 45.95,21.34 43.93,23.36 RPI1.S29 RPI1.29 | RPI1.29
GPIO6  (via drill 0.35)
  Top 0.254: SW1.A' SW1.A 54.06,17.78 53.44,17.78 52.93,18.29 v52.93,18.54
  Bottom 0.254: v52.93,18.54 52.93,21.21 52.04,22.1 47.09,22.1 46.47,22.72 RPI1.S31 RPI1.31 | RPI1.31
MISO  (via drill 0.35)
  Top 0.254: TC1.1 53.44,2.41 53.44,2.36 | v53.57,1.27 53.57,2.23 53.44,2.36 | U5.16 50.92,3.54 51.28,3.17 51.28,2.41 51.79,1.91 53.06,1.91 53.44,2.29 53.44,2.36
  Bottom 0.254: U11.2 41.46,8.72 40.61,7.87 40.61,5.08 40.81,4.88 40.81,3.39 42.25,1.96 46.11,1.96 46.44,2.29 50.03,2.29 50.35,1.96 52.88,1.96 v53.57,1.27
MOSI  (via drill 0.35)
  Top 0.254: U5.15 49.23,2.84 49.4,2.67 v50.65,2.67 | TC1.4 v54.84,4.7
  Bottom 0.254: 52.17,6.35 53.82,4.7 v54.84,4.7 | U11.3 47.79,10.72 48.43,10.08 50.71,10.08 51.02,9.77 51.02,7.5 51.66,6.86 52.17,6.35 | v50.65,2.67 50.65,3.43 52.17,4.95 52.17,6.35
N$1
  Top 0.254: U1.7 U1.8 10.88,9.54 R12.2
N$2
  Top 0.254: U2.RXD 33.68,7.32 33.12,7.87 33.12,9.4 33.63,9.91 R20.2
N$3
  Top 0.254: U2.TXD 37.02,9.23 37.19,9.4 R19.2
N$4
  Top 0.254: U5.8 45.06,3.47 45.06,2.67 44.75,2.36 X1.3
N$5
  Top 0.254: U5.7 44.53,4.59 44.42,4.7 43.34,4.7 X1.1
N$6
  Top 0.254: U4.23 8.83,6 R8.2 9.12,6.99 9.12,8.64 8.59,9.16 U1.6
N$7  (via drill 0.35)
  Top 0.254: U4.24 8.5,5.35 R7.2 8.48,4.83 7.98,4.32 v7.98,3.56 | v8,8 8.09,8.1 U1.5
  Bottom 0.254: v8,8 8,3.58 v7.98,3.56
N$8
  Top 0.254: R3.1 47,0.89 STAT.A
N$9
  Top 0.254: U4.3 12.15,0.9 12.55,0.51 16.87,0.51 17.25,0.89 R1.2
N$17  (via drill 0.35)
  Top 0.254: U2.CBUS1 39.26,6.82 40.61,5.46 40.61,4.57 v40.11,4.06 | RX.C 39.16,1.88 v39.16,2.16
  Bottom 0.254: v40.11,4.06 39.16,3.12 v39.16,2.16
N$18
  Top 0.254: U2.CBUS2 36.02,3.66 35.66,3.3 34.14,3.3 33.6,2.76 TX.C
N$25  (via drill 0.35)
  Top 0.254: R15.2 10.64,20.07 v11.02,19.68 | U2.USBDM 37.02,3.6 v37.57,3.05
  Bottom 0.254: v11.02,19.68 12.8,17.91 12.8,12.19 14.33,10.67 30.71,10.67 32.61,8.76 32.61,4.95 33.76,3.81 36.8,3.81 v37.57,3.05
N$26  (via drill 0.35)
  Top 0.254: R11.1 9.88,19.05 v10.39,18.54 | U2.USBDP 36.52,3.14 v36.42,3.05
  Bottom 0.254: v10.39,18.54 11.66,17.27 11.66,11.68 13.94,9.4 16.99,9.4 22.07,4.32 31.6,4.32 32.61,3.3 36.17,3.3 v36.42,3.05
N$27
  Top 0.254: RX.A 41.12,1.74 R18.1
N$29
  Top 0.254: TX.A 34.77,1.94 R17.2
N$32
  Top 0.254: R15.1 6.45,20.07 6.07,20.45 5.96,20.56 5.58,20.94 J6.D-
N$33
  Top 0.254: R11.2 6.58,19.05 5.34,20.29 J6.D+
RESET  (via drill 0.35)
  Top 0.254: U5.29 47.73,8.77 47.98,9.02 R5.1 C12.1 46.96,12.7 v47.85,13.59 | TC1.5 v56.11,1.27
  Bottom 0.254: v47.85,13.59 48.32,14.05 51.07,14.05 53.57,11.56 53.57,9.27 55.22,7.62 55.22,6.48 56.11,5.59 v56.11,1.27
RX  (via drill 0.35)
  Top 0.254: v33.63,20.32 34.14,19.81 37.19,19.81 38.2,18.8 R19.1 40.49,9.91 v40.67,9.73 | v47.09,9.2 47.23,9.06 U5.30
  Bottom 0.254: v33.63,20.32 32.99,20.95 19.16,20.95 17.25,22.87 17.25,27.4 RPI1.S8 RPI1.8 | v40.67,9.73 46.44,9.73 46.96,9.2 v47.09,9.2 | RPI1.8
SCK  (via drill 0.35)
  Top 0.254: TC1.3 v54.84,1.27 | v52.55,4.32 52.33,4.09 U5.17
  Bottom 0.254: U11.4 46.44,12.72 48.62,10.54 50.9,10.54 51.66,9.78 51.66,7.62 52.3,6.99 53.44,6.99 55.47,4.95 55.47,1.91 v54.84,1.27 54.71,1.27 53.44,2.54 53.44,3.43 v52.55,4.32
SCL  (via drill 0.35)
  Top 0.254: U1.2 9.09,13.95 R10.2 v9.12,14.86 | v9.75,21.97 12.04,21.97 13.44,23.37 13.44,25.22 RPI1.5
  Bottom 0.254: U$1.P$3 16.07,17.94 16.1,17.91 16.99,18.8 16.99,21.21 16.23,21.97 14.07,21.97 13.45,22.59 RPI1.S5 RPI1.5 | RPI1.5 | v9.75,21.97 9.12,21.34 v9.12,14.86
SDA  (via drill 0.35)
  Top 0.254: R6.2 6.83,13.46 7.09,13.21 v8.36,13.21 8.59,12.97 U1.3
  Bottom 0.254: 10.91,21.7 RPI1.S3 RPI1.3 | 10.91,21.7 12.17,20.45 15.16,20.45 U$1.P$4 | RPI1.3 | 10.91,21.7 9.75,20.55 9.75,18.03 10.9,16.89 10.9,13.08 10.26,12.45 9.12,12.45 v8.36,13.21
SS  (via drill 0.35)
  Top 0.254: v52.3,7.87 R9.1 53.44,6.99 60.3,6.99 v60.3,6.86 | U5.14 48.73,2.42 50.02,1.14 v50.39,1.14
  Bottom 0.254: U11.5 45.46,14.72 48.87,11.3 51.16,11.3 52.3,10.16 52.3,8.89 v52.3,7.87 | v60.3,6.86 60.3,5.46 58.9,4.06 58.9,1.65 57.89,0.64 52.93,0.64 52.07,1.5 50.75,1.5 v50.39,1.14
TX  (via drill 0.35)
  Top 0.254: R20.1 v35.53,10.92 v35.53,18.67 | U5.31 46.73,8.54 45.82,9.45 42.45,9.45 41.88,8.89 38.96,8.89 v38.33,8.26
  Bottom 0.254: v35.53,18.67 35.53,19.68 33.63,21.59 20.42,21.59 19.79,22.23 19.79,27.4 RPI1.S10 RPI1.10 | v35.53,10.92 38.2,8.26 v38.33,8.26 | RPI1.10
VCC  (via drill 0.35)
  Top 0.254: R5.2 50.14,10.03 52.68,12.57 52.68,13.97 53.7,14.99 v60.55,14.99
  Top 0.305: U5.6 45.05,5.09 44.05,6.09 | C15.2 43.79,6.35 44.05,6.09 | U5.4 44.05,6.09 | U5.18 50.79,4.59 v51.35,5.14
  Top 0.508: v51.35,5.14 C5.2 R9.2 53.57,5.84 54.08,6.35 59.28,6.35 59.79,5.84 60.68,5.84 v61.32,6.48 R23.1 | v39.73,7.75 39.73,7.24 v41.76,5.21 42.9,6.35 C15.2
  Top 0.61: v33.38,13.34 32.49,14.22 26.26,14.22 22.58,10.54 C11.2 C8.2 20.06,9.53 U8.2
  Bottom 0.254: v60.55,14.99 61.32,14.22 61.32,10.92
  Bottom 0.508: v33.38,13.34 39.09,13.34 40.11,12.32 40.11,10.79 39.73,10.41 v39.73,7.75 | U11.13 59.65,12.72 v61.32,11.05 61.32,10.92 61.32,10.54 60.43,9.65 60.43,8.26 61.32,7.37 v61.32,6.48 | v51.35,5.14 41.82,5.14 v41.76,5.21
VIN
  Top 0.61: D2.C 12.93,19.23 12.93,21.21 14.58,22.86 16.1,22.86 17.75,21.21 C10.2 17.75,8.55 U8.3

### Text on the board
tPlace: RPi | Servo
bPlace: TRV Control Node / v0.4.3 / August 2018 | Designed by / Akram Ali